# EAGLE design rpiInterface (EAGLE 9.4.2)
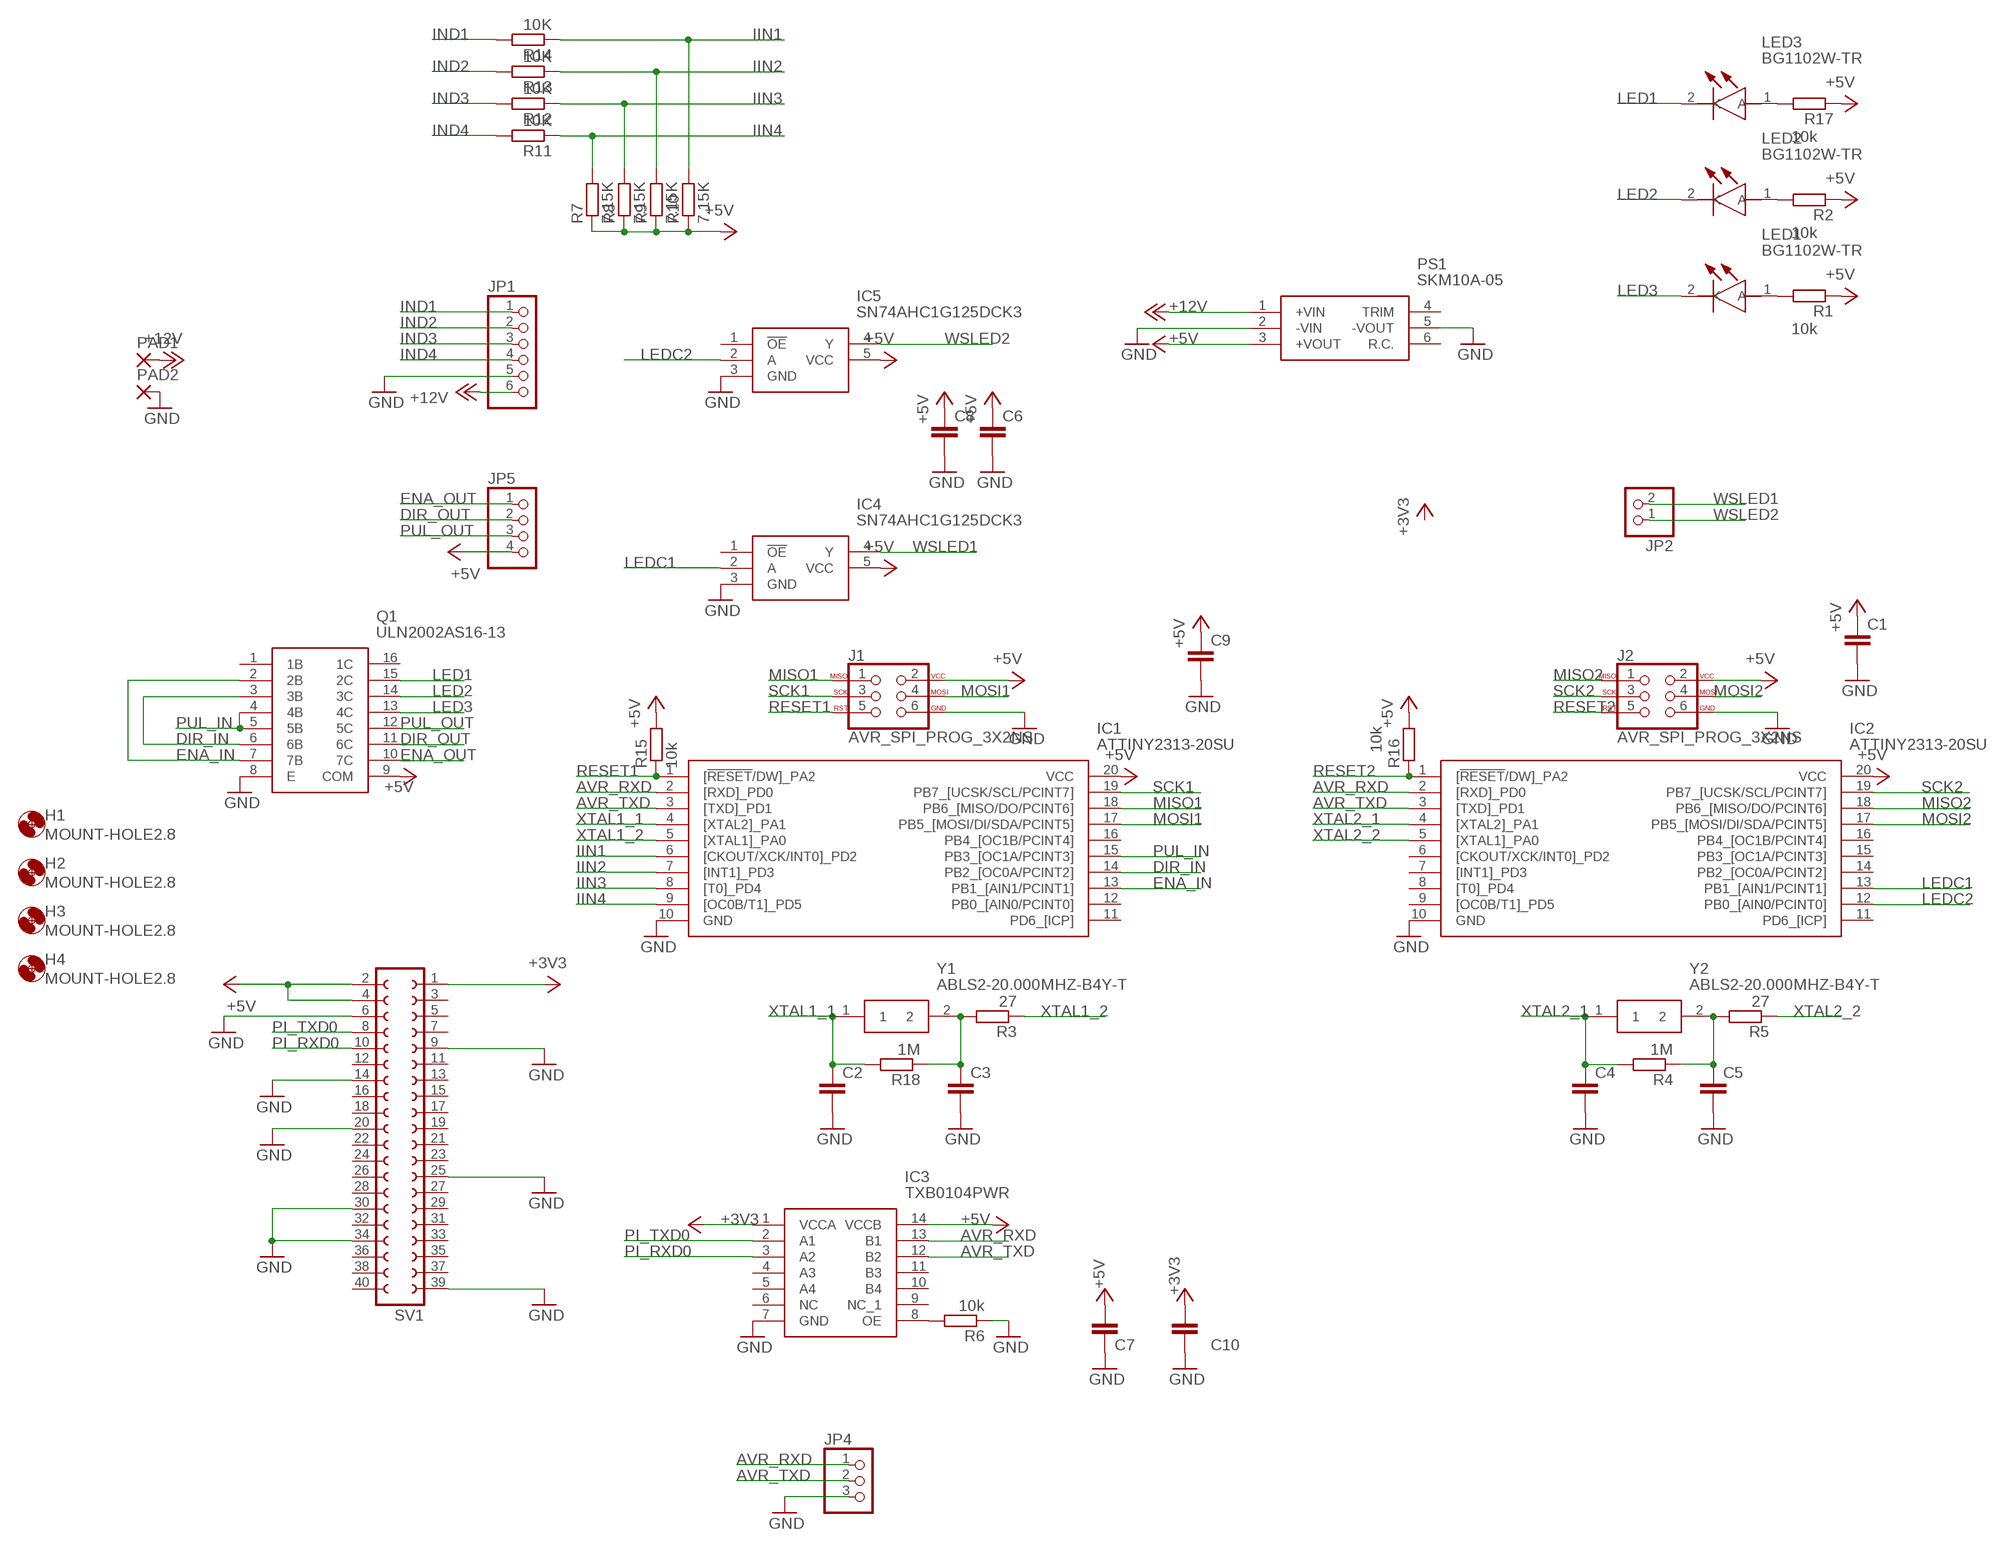
[diagram p0: schematic, sheet 1]

## Parts
C1  C-EUC1206  [C1206]
C2  C-EUC1206  [C1206]
C3  C-EUC1206  [C1206]
C4  C-EUC1206  [C1206]
C5  C-EUC1206  [C1206]
C6  C-EUC1206  [C1206]
C7  C-EUC1206  [C1206]
C8  C-EUC1206  [C1206]
C9  C-EUC1206  [C1206]
C10  C-EUC1206  [C1206]
H1  MOUNT-HOLE2.8  [2,8]
H2  MOUNT-HOLE2.8  [2,8]
H3  MOUNT-HOLE2.8  [2,8]
H4  MOUNT-HOLE2.8  [2,8]
IC1  ATTINY2313-20SU  [SOIC127P1032X265-20N]
IC2  ATTINY2313-20SU  [SOIC127P1032X265-20N]
IC3  TXB0104PWR  [SOP65P640X120-14N]
IC4  SN74AHC1G125DCK3  [SOT65P210X110-5N]
IC5  SN74AHC1G125DCK3  [SOT65P210X110-5N]
J1  AVR_SPI_PROG_3X2NS  [2X3-NS]
J2  AVR_SPI_PROG_3X2NS  [2X3-NS]
JP1  PINHD-1X6  [1X06]
JP2  PINHD-1X2  [1X02]
JP4  PINHD-1X3  [1X03]
JP5  PINHD-1X4  [1X04]
LED1  BG1102W-TR  [BG1102WTR]
LED2  BG1102W-TR  [BG1102WTR]
LED3  BG1102W-TR  [BG1102WTR]
PAD1  3,17/1,3  [3,17/1,3]
PAD2  3,17/1,3  [3,17/1,3]
PS1  SKM10A-05  [SKM10A05]
Q1  ULN2002AS16-13  [SOIC127P605X126-16N]
R1  10k  R-EU_R1206  [R1206]
R2  10k  R-EU_R1206  [R1206]
R3  27  R-EU_R1206  [R1206]
R4  1M  R-EU_R1206  [R1206]
R5  27  R-EU_R1206  [R1206]
R6  10k  R-EU_R1206  [R1206]
R7  7.15K  R-EU_R1206  [R1206]
R8  7.15K  R-EU_R1206  [R1206]
R9  7.15K  R-EU_R1206  [R1206]
R10  7.15K  R-EU_R1206  [R1206]
R11  10K  R-EU_R1206  [R1206]
R12  10K  R-EU_R1206  [R1206]
R13  10K  R-EU_R1206  [R1206]
R14  10K  R-EU_R1206  [R1206]
R15  10k  R-EU_R1206  [R1206]
R16  10k  R-EU_R1206  [R1206]
R17  10k  R-EU_R1206  [R1206]
R18  1M  R-EU_R1206  [R1206]
SV1  FE20-2  [FE20-2]
Y1  ABLS2-20.000MHZ-B4Y-T  [HC/49US-(AT49)_1]
Y2  ABLS2-20.000MHZ-B4Y-T  [HC/49US-(AT49)_1]

## Nets
+3V3: C10.1 IC3.1(VCCA) SV1.1
+5V: C1.1 C6.1 C7.1 C8.1 C9.1 IC1.20(VCC) IC2.20(VCC) IC3.14(VCCB) IC4.5(VCC) IC5.5(VCC) J1.2 J2.2 JP5.4 PS1.3(+VOUT) Q1.9(COM) R1.1 R2.1 R7.1 R8.1 R9.1 R10.1 R15.2 R16.2 R17.1 SV1.2 SV1.4
+12V: JP1.6 PAD1.1(P) PS1.1(+VIN)
AVR_RXD: IC1.2([RXD]_PD0) IC2.2([RXD]_PD0) IC3.13(B1) JP4.1
AVR_TXD: IC1.3([TXD]_PD1) IC2.3([TXD]_PD1) IC3.12(B2) JP4.2
DIR_IN: IC1.14(PB2_[OC0A/PCINT2]) Q1.3(3B) Q1.6(6B)
DIR_OUT: JP5.2 Q1.11(6C)
ENA_IN: IC1.13(PB1_[AIN1/PCINT1]) Q1.2(2B) Q1.7(7B)
ENA_OUT: JP5.1 Q1.10(7C)
GND: C1.2 C2.2 C3.2 C4.2 C5.2 C6.2 C7.2 C8.2 C9.2 C10.2 IC1.10(GND) IC2.10(GND) IC3.7(GND) IC4.3(GND) IC5.3(GND) J1.6 J2.6 JP1.5 JP4.3 PAD2.1(P) PS1.2(-VIN) PS1.5(-VOUT) Q1.8(E) R6.1 SV1.6 SV1.9 SV1.14 SV1.20 SV1.25 SV1.30 SV1.34 SV1.39
IIN1: IC1.6([CKOUT/XCK/INT0]_PD2) R10.2 R14.1
IIN2: IC1.7([INT1]_PD3) R9.2 R13.1
IIN3: IC1.8([T0]_PD4) R8.2 R12.1
IIN4: IC1.9([OC0B/T1]_PD5) R7.2 R11.1
IND1: JP1.1 R14.2
IND2: JP1.2 R13.2
IND3: JP1.3 R12.2
IND4: JP1.4 R11.2
LED1: LED3.2(K) Q1.15(2C)
LED2: LED2.2(K) Q1.14(3C)
LED3: LED1.2(K) Q1.13(4C)
LEDC1: IC2.13(PB1_[AIN1/PCINT1]) IC4.2(A)
LEDC2: IC2.12(PB0_[AIN0/PCINT0]) IC5.2(A)
MISO1: IC1.18(PB6_[MISO/DO/PCINT6]) J1.1
MISO2: IC2.18(PB6_[MISO/DO/PCINT6]) J2.1
MOSI1: IC1.17(PB5_[MOSI/DI/SDA/PCINT5]) J1.4
MOSI2: IC2.17(PB5_[MOSI/DI/SDA/PCINT5]) J2.4
N$1: C3.1 R3.2 R18.1 Y1.2
N$2: C5.1 R4.1 R5.2 Y2.2
N$3: LED1.1(A) R1.2
N$4: LED2.1(A) R2.2
N$5: LED3.1(A) R17.2
N$6: IC3.8(OE) R6.2
PI_RXD0: IC3.3(A2) SV1.10
PI_TXD0: IC3.2(A1) SV1.8
PUL_IN: IC1.15(PB3_[OC1A/PCINT3]) Q1.4(4B) Q1.5(5B)
PUL_OUT: JP5.3 Q1.12(5C)
RESET1: IC1.1([!RESET!/DW]_PA2) J1.5 R15.1
RESET2: IC2.1([!RESET!/DW]_PA2) J2.5 R16.1
SCK1: IC1.19(PB7_[UCSK/SCL/PCINT7]) J1.3
SCK2: IC2.19(PB7_[UCSK/SCL/PCINT7]) J2.3
WSLED1: IC4.4(Y) JP2.2
WSLED2: IC5.4(Y) JP2.1
XTAL1_1: C2.1 IC1.4([XTAL2]_PA1) R18.2 Y1.1
XTAL1_2: IC1.5([XTAL1]_PA0) R3.1
XTAL2_1: C4.1 IC2.4([XTAL2]_PA1) R4.2 Y2.1
XTAL2_2: IC2.5([XTAL1]_PA0) R5.1
Unconnected: IC1.11(PD6_[ICP]) IC1.12(PB0_[AIN0/PCINT0]) IC1.16(PB4_[OC1B/PCINT4]) IC2.6([CKOUT/XCK/INT0]_PD2) IC2.7([INT1]_PD3) IC2.8([T0]_PD4) IC2.9([OC0B/T1]_PD5) IC2.11(PD6_[ICP]) IC2.14(PB2_[OC0A/PCINT2]) IC2.15(PB3_[OC1A/PCINT3]) IC2.16(PB4_[OC1B/PCINT4]) IC3.4(A3) IC3.5(A4) IC3.6(NC) IC3.9(NC_1) IC3.10(B4) IC3.11(B3) IC4.1(!OE) IC5.1(!OE) PS1.4(TRIM) PS1.6(R.C.) Q1.1(1B) Q1.16(1C) SV1.3 SV1.5 SV1.7 SV1.11 SV1.12 SV1.13 SV1.15 SV1.16 SV1.17 SV1.18 SV1.19 SV1.21 SV1.22 SV1.23 SV1.24 SV1.26 SV1.27 SV1.28 SV1.29 SV1.31 SV1.32 SV1.33 SV1.35 SV1.36 SV1.37 SV1.38 SV1.40

## Library data of the parts
C1-C10 = rcl:C-EU: CAPACITOR, European symbol; SPICEPREFIX: C
H1-H4 = holes:MOUNT-HOLE: MOUNTING HOLE with drill center marker
IC1 IC2 = SamacSys_Parts:ATTINY2313-20SU: ATTINY2313-20SU, 8 bit AVR Microcontroller 20MHz 2, 128kB, B Flash, 128B RAM, I2C SPI 20-Pin SOIC Source: Datasheet <https://componentsearchengine.com/Datasheets/1/ATTINY2313-20SU.pdf>; DESCRIPTION: ATTINY2313-20SU, 8 bit AVR Microcontroller 20MHz 2, 128kB, B Flash, 128B RAM, I2C SPI 20-Pin SOIC; HEIGHT: 2.65mm; MANUFACTURER_NAME: Microchip; MANUFACTURER_PART_NUMBER: ATTINY2313-20SU; MOUSER_PART_NUMBER: 556-ATTINY2313-20SU; MOUSER_PRICE-STOCK: https://www.mouser.com/Search/Refine.aspx?Keyword=556-ATTINY2313-20SU
IC3 = SamacSys_Parts:TXB0104PWR: 4-Bit Bidirectional Voltage-Level Shifter with Auto Direction Sensing and +/-15 kV ESD Protect Source: Datasheet <http://www.ti.com/lit/ds/symlink/txb0104.pdf>; DESCRIPTION: 4-Bit Bidirectional Voltage-Level Shifter with Auto Direction Sensing and +/-15 kV ESD Protect; HEIGHT: 1.2mm; MANUFACTURER_NAME: Texas Instruments; MANUFACTURER_PART_NUMBER: TXB0104PWR; MOUSER_PART_NUMBER: 595-TXB0104PWR; MOUSER_PRICE-STOCK: https://www.mouser.com/Search/Refine.aspx?Keyword=595-TXB0104PWR
IC4 IC5 = SamacSys_Parts:SN74AHC1G125DCK3: Buffers & Line Drivers SN74AHC1G125DCK3 Source: Datasheet <http://www.ti.com/lit/ds/symlink/sn74ahc1g125.pdf>; DESCRIPTION: Buffers & Line Drivers SN74AHC1G125DCK3; HEIGHT: 1.1mm; MANUFACTURER_NAME: Texas Instruments; MANUFACTURER_PART_NUMBER: SN74AHC1G125DCK3; MOUSER_PART_NUMBER: 595-SN74AHC1G125DCK3; MOUSER_PRICE-STOCK: https://www.mouser.com/Search/Refine.aspx?Keyword=595-SN74AHC1G125DCK3
J1 J2 = SparkFun-Connectors:AVR_SPI_PROG_3X2: AVR ISP 6 Pin This is the reduced ISP connector for AVR programming. Common on Arduino. This footprint will take up less PCB space and can be used with a 10-pin to 6-pin adapter such as SKU: BOB-08508 **Special note about "TEST_POINT" package. The stop mask is on the top side, so if you want your programming test points to be on the bottom of your board, make sure to place this package on the bottom side of the board. This also ensure that the orientation to program from the bottom side will be correct. SparkFun Products: SparkFun ISP Pogo Adapter <https://www.sparkfun.com/products/11591> - NS Tiny AVR Programmer <https://www.sparkfun.com/products/11801> -PTH
JP1 = pinhead:PINHD-1X6: PIN HEADER
JP2 = pinhead:PINHD-1X2: PIN HEADER
JP4 = pinhead:PINHD-1X3: PIN HEADER
JP5 = pinhead:PINHD-1X4: PIN HEADER
LED1-LED3 = SamacSys_Parts:BG1102W-TR: Stanley Electric 1102W 558 nm Green LED, 3216 (1206) SMD package Source: Datasheet <https://media.digikey.com/pdf/Data Sheets/Stanley Electric PDFs/1102W_Series.pdf>; DESCRIPTION: Stanley Electric 1102W 558 nm Green LED, 3216 (1206) SMD package; HEIGHT: 1mm; MANUFACTURER_NAME: Stanley Electric; MANUFACTURER_PART_NUMBER: BG1102W-TR; MOUSER_PART_NUMBER: 327-BG1102WTR; MOUSER_PRICE-STOCK: https://www.mouser.com/Search/Refine.aspx?Keyword=327-BG1102WTR
PAD1 PAD2 = wirepad:3,17/1,3: THROUGH-HOLE PAD
PS1 = SamacSys_Parts:SKM10A-05: Isolated DC/DC Converters 9-18Vin 5Vout 2000mA DIP Iso Reg Source: Datasheet <https://www.arrow.com/en/products/skm10a-05/mean-well-enterprises>; DESCRIPTION: Isolated DC/DC Converters 9-18Vin 5Vout 2000mA DIP Iso Reg; HEIGHT: 10.7mm; MANUFACTURER_NAME: Mean Well; MANUFACTURER_PART_NUMBER: SKM10A-05; MOUSER_PART_NUMBER: 709-SKM10A-05; MOUSER_PRICE-STOCK: https://www.mouser.com/Search/Refine.aspx?Keyword=709-SKM10A-05
Q1 = SamacSys_Parts:ULN2002AS16-13: Darlington Transistors High Volt Darlington 7Drivers 500mA 250ns Source: Datasheet <https://componentsearchengine.com/Datasheets/1/ULN2002AS16-13.pdf>; DESCRIPTION: Darlington Transistors High Volt Darlington 7Drivers 500mA 250ns; HEIGHT: 1.26mm; MANUFACTURER_NAME: Diodes Inc.; MANUFACTURER_PART_NUMBER: ULN2002AS16-13; MOUSER_PART_NUMBER: 621-ULN2002AS16-13; MOUSER_PRICE-STOCK: https://www.mouser.com/Search/Refine.aspx?Keyword=621-ULN2002AS16-13
R1-R18 = rcl:R-EU_: RESISTOR, European symbol; SPICEPREFIX: R
SV1 = con-lsta:FE20-2: FEMALE HEADER; OC_FARNELL: unknown; OC_NEWARK: unknown
Y1 Y2 = SamacSys_Parts:ABLS2-20.000MHZ-B4Y-T: Crystals 20.000MHZ, 18pF 30ppm -20C +70C Source: Datasheet <https://componentsearchengine.com/Datasheets/1/ABLS2-20.000MHz-B4Y-T.pdf>; DESCRIPTION: Crystals 20.000MHZ, 18pF 30ppm -20C +70C; HEIGHT: mm; MANUFACTURER_NAME: ABRACON; MANUFACTURER_PART_NUMBER: ABLS2-20.000MHz-B4Y-T; MOUSER_PART_NUMBER: 815-ABLS2-20-B4YT; MOUSER_PRICE-STOCK: https://www.mouser.com/Search/Refine.aspx?Keyword=815-ABLS2-20-B4YT

## Board
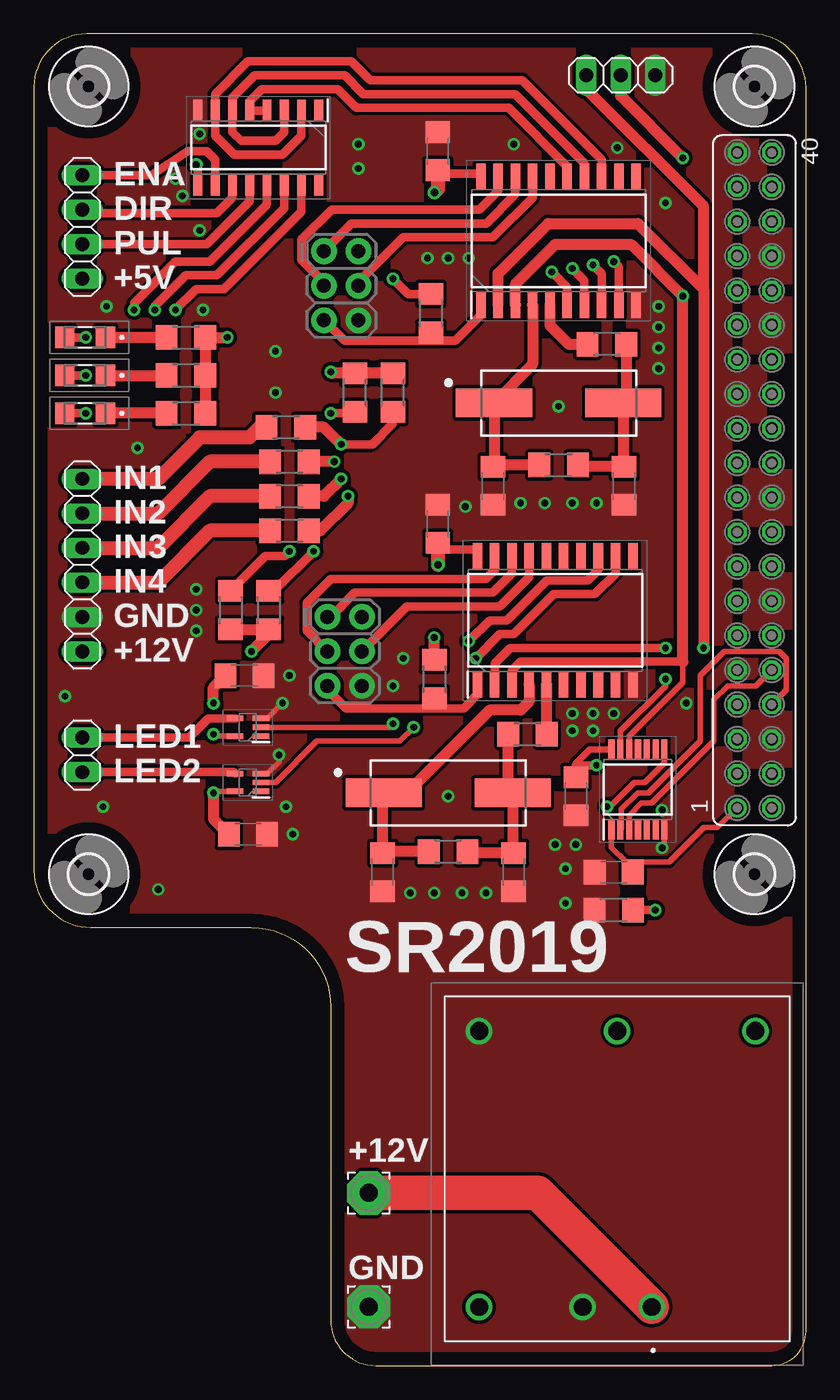
[diagram p1: board, top side]
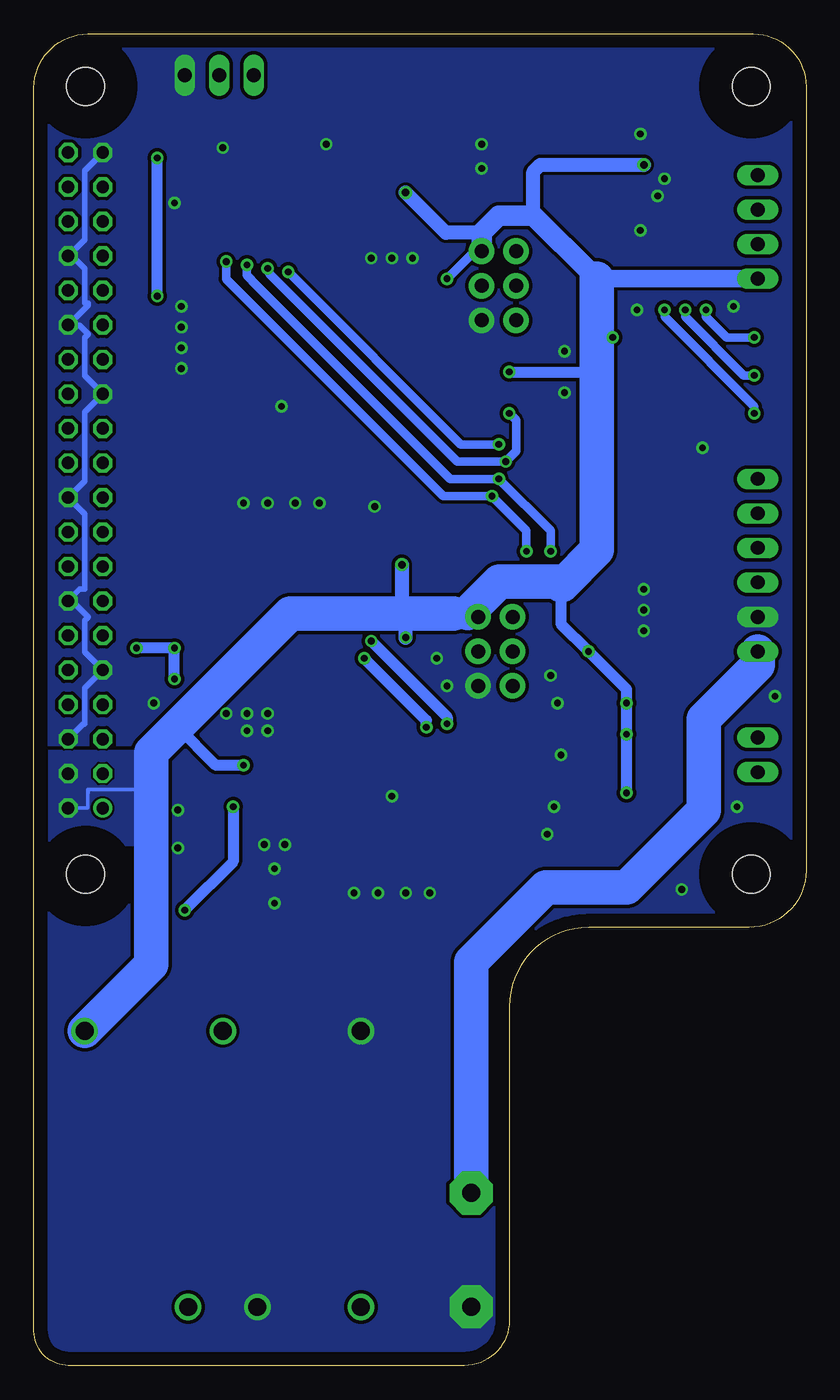
[diagram p2: board, bottom side, seen from below]

Size 56.82 x 98.03 mm. Coordinates in mm from the lower left corner, seen from the top.
Outline: 21.84,26.42 21.84,3.3 arc90 25.15,0 54.28,0 arc90 56.82,2.54 56.82,94.08 arc90 52.86,98.03 3.88,98.03 arc90 0,94.16 0,36.44 arc90 4.19,32.26 16,32.26 arc-90 21.84,26.42
Copper layers (1*16): Top 0.035mm / dielectric 1.5mm / Bottom 0.035mm
Design rules "default *": minimum track width 6mil, minimum drill 0.35mm, track to track 6mil, track to pad 6mil, pad to pad 6mil, via to via 6mil, smd to smd 6mil, copper to edge 40mil, drill to drill 6mil, minimum pad ring 10mil, minimum via ring 8mil, stop-mask expansion 4mil, vias tented up to drill 50mil, thermal gap 10mil

### Footprints (pad centres in the part's own frame; a part is rotated, then mirrored left to right if it is on the bottom)
C1206 = smd 1.6 x 1.8: 1 -1.4,0; 2 1.4,0
2,8 = hole 2.8: 0,0
SOIC127P1032X265-20N = smd 1.925 x 0.7: 1 -4.712,5.715; 2 -4.712,4.445; 3 -4.712,3.175; 4 -4.712,1.905; 5 -4.712,0.635; 6 -4.712,-0.635; 7 -4.712,-1.905; 8 -4.712,-3.175; 9 -4.712,-4.445; 10 -4.712,-5.715; 11 4.712,-5.715; 12 4.712,-4.445; 13 4.712,-3.175; 14 4.712,-1.905; 15 4.712,-0.635; 16 4.712,0.635; 17 4.712,1.905; 18 4.712,3.175; 19 4.712,4.445; 20 4.712,5.715
SOP65P640X120-14N = smd 1.475 x 0.45: 1 -2.938,1.95; 2 -2.938,1.3; 3 -2.938,0.65; 4 -2.938,0; 5 -2.938,-0.65; 6 -2.938,-1.3; 7 -2.938,-1.95; 8 2.938,-1.95; 9 2.938,-1.3; 10 2.938,-0.65; 11 2.938,0; 12 2.938,0.65; 13 2.938,1.3; 14 2.938,1.95
SOT65P210X110-5N = smd 1.2 x 0.4: 1 -0.95,0.65; 2 -0.95,0; 3 -0.95,-0.65; 4 0.95,-0.65; 5 0.95,0.65
2X3-NS = drill 1.016 pad 1.88: 1 -2.54,-1.27; 2 -2.54,1.27; 3 0,-1.27; 4 0,1.27; 5 2.54,-1.27; 6 2.54,1.27
1X06 = drill 1.016 long: 1 -6.35,0; 2 -3.81,0; 3 -1.27,0; 4 1.27,0; 5 3.81,0; 6 6.35,0
1X02 = drill 1.016 long: 1 -1.27,0; 2 1.27,0
1X03 = drill 1.016 long: 1 -2.54,0; 2 0,0; 3 2.54,0
1X04 = drill 1.016 long: 1 -3.81,0; 2 -1.27,0; 3 1.27,0; 4 3.81,0
BG1102WTR = smd 1.6 x 1.4: 1 0,1.2; 2 0,-1.8
3,17/1,3 = drill 1.321 pad 3.175 octagon: 1 0,0
SKM10A05 = drill 1.3 pad 1.95: 1 0,0; 2 -5.08,0; 3 7.62,20.32; 4 -2.54,20.32; 5 -12.7,20.32; 6 -12.7,0
SOIC127P605X126-16N = smd 1.575 x 0.65: 1 -2.738,4.445; 2 -2.738,3.175; 3 -2.738,1.905; 4 -2.738,0.635; 5 -2.738,-0.635; 6 -2.738,-1.905; 7 -2.738,-3.175; 8 -2.738,-4.445; 9 2.738,-4.445; 10 2.738,-3.175; 11 2.738,-1.905; 12 2.738,-0.635; 13 2.738,0.635; 14 2.738,1.905; 15 2.738,3.175; 16 2.738,4.445
R1206 = smd 1.6 x 1.803: 1 -1.422,0; 2 1.422,0
FE20-2 = drill 0.914: 1 -24.13,1.27 | drill 0.914 octagon: 2 -24.13,-1.27; 3 -21.59,1.27; 4 -21.59,-1.27; 5 -19.05,1.27; 6 -19.05,-1.27; 7 -16.51,1.27; 8 -16.51,-1.27; 9 -13.97,1.27; 10 -13.97,-1.27; 11 -11.43,1.27; 12 -11.43,-1.27; 13 -8.89,1.27; 14 -8.89,-1.27; 15 -6.35,1.27; 16 -6.35,-1.27; 17 -3.81,1.27; 18 -3.81,-1.27; 19 -1.27,1.27; 20 -1.27,-1.27; 21 1.27,1.27; 22 1.27,-1.27; 23 3.81,1.27; 24 3.81,-1.27; 25 6.35,1.27; 26 6.35,-1.27; 27 8.89,1.27; 28 8.89,-1.27; 29 11.43,1.27; 30 11.43,-1.27; 31 13.97,1.27; 32 13.97,-1.27; 33 16.51,1.27; 34 16.51,-1.27; 35 19.05,1.27; 36 19.05,-1.27; 37 21.59,1.27; 38 21.59,-1.27; 39 24.13,1.27; 40 24.13,-1.27
HC/49US-(AT49)_1 = smd 5.6 x 2.1: 1 -4.75,0; 2 4.75,0

### Placement (x,y rotation side)
C1  39.88,41.91 270 top
C2  33.78,64.77 270 top
C3  43.43,64.77 270 top
C4  25.65,36.32 270 top
C5  35.31,36.32 270 top
C6  15.75,39.12 0 top
C7  29.72,61.98 90 top
C8  15.49,50.8 0 top
C9  29.72,89.41 90 top
C10  42.67,36.32 180 top
H1  4.03,36.17 0 top
H2  53.03,36.17 0 top
H3  4.03,94.17 0 top
H4  53.03,94.17 0 top
IC1  38.61,82.8 90 top
IC2  38.35,54.86 90 top
IC3  44.45,42.42 90 top
IC4  15.75,46.99 180 top
IC5  15.75,42.93 180 top
J1  22.61,79.5 270 top
J2  22.86,52.58 270 top
JP1  3.56,58.93 270 top
JP2  3.56,44.96 90 top
JP4  43.18,95 0 top
JP5  3.56,83.82 270 top
LED1  4.06,75.69 270 top
LED2  4.06,72.9 270 top
LED3  4.06,70.1 270 top
PAD1  24.64,12.7 0 top
PAD2  24.64,4.32 0 top
PS1  45.47,4.32 0 top
Q1  16.51,89.66 270 top
R1  11.18,75.69 180 top
R2  11.18,72.9 180 top
R3  42.16,75.18 0 top
R4  30.48,37.85 180 top
R5  36.32,46.48 180 top
R6  42.67,33.53 0 top
R7  17.27,55.63 90 top
R8  14.48,55.63 90 top
R9  23.62,71.63 270 top
R10  26.42,71.63 270 top
R11  18.8,61.47 180 top
R12  18.8,64.01 180 top
R13  18.8,66.55 180 top
R14  18.54,69.09 180 top
R15  29.21,77.47 90 top
R16  29.46,50.55 90 top
R17  11.18,70.1 180 top
R18  38.61,66.29 180 top
SV1  53.03,65.17 90 top
Y1  38.61,70.87 0 top
Y2  30.48,42.16 0 top

### Tracks (layer width: path | path; a pad name or v marks a point on that pad's centre or on a via)
+3V3
  Top 0.406: SV1.1 50.29,39.62 49.28,39.62 46.74,37.08 43.94,37.08 | IC3.1 42.5,38.16 43.57,37.08 43.94,37.08 | C10.1 44.07,36.95 43.94,37.08
+5V  (via drill 0.5, 0.55)
  Top 0.406: IC5.5 13.32,42.28 v13.21,42.16 | IC4.5 13.35,46.34 v13.21,46.48
  Top 0.508: IC3.14 42.48,45.33 40.89,45.34 39.88,44.33 C1.1
  Top 0.61: C9.1 29.97,87.75 32.66,87.75 IC1.20 | C7.1 30.23,60.07 32.64,60.07 IC2.20 | v26.42,80.01 27.53,78.89 R15.2 | C1.1 39.88,44.2 v41.4,44.2 | Q1.9 12.06,88.27 v11.94,88.39
  Top 0.813: R8.1 R7.1 17.27,53.85 v16,52.58 | R17.1 R2.1 R1.1 v14.22,75.69 | R16.2 v29.46,53.59 | R10.1 R9.1 21.95,73.05 v21.84,73.15 | v13.21,48.77 13.21,49.91 C8.1 | v13.21,42.16 13.21,40.26 C6.1
  Top 1.016: v29.74,58.95 29.74,60.55 C7.1 | C9.1 29.72,86.61 v29.46,86.36
  Bottom 0.254: SV1.2 52.85,41.04 52.85,42.14 | 52.85,42.14 52.83,42.14 52.83,42.42 | 52.85,42.14 52.85,42.42 48.2,42.42
  Bottom 0.61: v26.42,80.01 24.38,82.04 J1.2 | 16,73.15 16,73.58 15.41,74.17 15.75,74.5 15.75,75.69 | 29.46,54.86 28.96,55.37 28.45,55.37 | 25.91,55.37 25.65,55.12 | J2.2 25.65,55.12 | 25.65,55.12 25.37,55.4 24.9,55.4 | 48.2,39.37 48.2,41.09 48.77,41.66 48.77,39.93 48.2,39.37
  Bottom 0.813: 18.03,57.73 18.03,57.48 18.03,54.61 v16,52.58 13.21,49.78 v13.21,48.77 v13.21,46.48 v13.21,42.16 | 29.74,55.14 29.46,54.86 | v21.84,73.15 16,73.15 | v14.22,75.69 15.75,75.69 | v41.4,44.2 43.43,44.2 46.29,47.05
  Bottom 1.016: 23.88,83.39 26.5,83.39 v29.46,86.36 | 20.06,84.66 20.06,87.89 19.56,88.39 v11.94,88.39 | v29.74,58.95 29.74,55.14 | v29.46,53.59 29.46,54.36 28.45,55.37
  Bottom 1.27: JP5.4 15.41,80.01 15.75,80.35
  Bottom 1.524: J1.2 23.88,83.39 22.61,84.66 20.06,84.66 15.75,80.35
  Bottom 2.54: PS1.3 48.2,29.52 48.2,39.37 48.2,42.42 48.2,45.13 46.29,47.05 37.97,55.37 28.45,55.37 25.91,55.37 | 24.9,55.4 22.57,57.73 18.03,57.73 | 18.03,57.48 17.96,57.48 15.41,60.03 15.41,74.17 15.41,80.01
  pour Bottom (no thermals): 49.28,45.21 55.88,45.21 55.88,38.35 49.28,38.35
+12V
  Top 2.54: PS1.1 37.08,12.7 PAD1.1
  Bottom 2.54: PAD1.1 24.64,29.72 19.15,35.21 13.19,35.21 7.52,40.88 7.52,47.6 3.56,51.56 JP1.6
AVR_RXD  (via drill 0.5)
  Top 0.406: v46.48,50.55 46.48,50.04 43.15,46.71 IC3.13
  Top 0.61: IC2.2 33.91,51.69 35.05,52.83 v46.48,52.83
  Top 0.813: IC1.2 34.16,80.39 37.85,84.07 44.45,84.07 49.28,79.25 | 49.28,79.25 v49.28,52.83 | 49.28,79.25 49.28,85.34 40.64,93.98 JP4.1
  Bottom 0.813: v46.48,50.55 v46.48,52.83 v49.28,52.83
AVR_TXD  (via drill 0.5)
  Top 0.406: 47.75,51.82 47.75,50.29 43.8,46.34 IC3.12
  Top 0.61: IC2.3 35.18,51.18 35.81,51.82 47.75,51.82
  Top 0.813: IC1.3 35.43,79.63 38.35,82.55 43.94,82.55 v47.75,78.74 47.75,51.82 | v47.75,88.9 43.18,93.47 JP4.2
  Bottom 0.813: v47.75,78.74 v47.75,88.9
DIR_IN
  Top 0.61: IC1.14 40.51,88.53 35.43,93.61 24.24,93.61 22.86,95 16.26,95 14.6,93.35 Q1.6 14.6,90.81 15.24,90.17 17.78,90.17 18.41,90.81 Q1.3
DIR_OUT
  Top 0.61: JP5.2 3.81,84.84 13.46,84.84 14.6,85.98 Q1.11
ENA_IN
  Top 0.61: IC1.13 41.78,88.79 35.94,94.63 24.75,94.63 23.37,96.01 15.75,96.01 13.33,93.6 Q1.7 13.33,90.55 14.73,89.15 18.29,89.15 19.69,90.55 Q1.2
ENA_OUT
  Top 0.61: JP5.1 8.64,87.63 11.3,89.41 12.7,89.41 13.33,88.77 Q1.10
GND  (via drill 0.5)
  Top 0.406: IC5.3 17.16,43.58 18.03,44.45 v18.03,44.96 | IC4.3 17.16,47.64 v18.29,48.77 | IC3.7 46.4,38.27 v46.23,38.1
  Bottom 0.406: SV1.6 53.18,47.24 53.09,47.24 53.09,49.88 SV1.9 53.09,52.53 53.09,54.86 52.83,55.12 54,56.28 SV1.14 53.43,57.15 53.09,57.15 53.09,62.69 SV1.20 53.09,65.12 53.09,70.2 SV1.25 51.76,71.57 53.09,72.9 53.09,75.69 52.83,75.95 53.49,76.6 SV1.30 52.83,78.07 52.83,78.23 53.09,78.23 53.09,80.77 54,81.68 SV1.34 53.09,82.9 53.09,87.98 SV1.39
  other vias: 35.31,89.92 28.96,81.53 31.75,63.25 41.4,63.5 35.81,63.5 27.69,34.8 42.67,48.01 29.46,34.8 10.92,86.11 10.41,87.38 23.88,89.92 23.88,88.14 30.48,81.53 32,81.53 12.19,83.57 37.59,63.5 39.62,63.5 33.27,34.8 31.5,34.8 39.88,38.35 39.12,36.58 38.35,38.35 46.23,40.89 39.12,34.04 18.54,41.15 19.05,39.12 18.8,50.8 26.42,50.04 27.18,52.07 11.94,57.15 11.94,54.1 11.94,55.63 17.78,74.68 17.78,71.63 12.45,77.72 7.62,67.56 5.33,77.98 12.19,90.68 46.48,85.6 30.48,41.91 38.61,70.61 45.97,77.98 45.97,76.45 45.97,74.93 45.97,73.41 41.15,48.01 39.62,48.01 39.62,46.74 41.15,46.74 9.14,35.05 5.08,41.15 2.29,49.28 48.01,48.77 42.93,89.66
  pour Top (isolate 0.254, no thermals): -1.02,99.06 58.67,99.06 58.67,-0.51 -1.02,-0.51
  pour Bottom (isolate 0.254, no thermals): -2.54,100.33 57.4,100.33 57.4,45.72 46.99,45.72 46.99,37.85 57.15,37.85 57.15,-9.51 -2.54,3.34
IIN1  (via drill 0.5)
  Top 0.61: IC1.6 39.24,79.38 v38.1,80.52 | v22.61,67.82 24.89,67.82 26.42,69.34 R10.2
  Top 0.813: v22.61,67.82 21.34,69.09 R14.1
  Bottom 0.61: v38.1,80.52 25.4,67.82 v22.61,67.82
IIN2  (via drill 0.5)
  Top 0.61: IC1.7 40.51,79.88 v39.62,80.77 | R9.2 23.52,70.1 v21.84,70.1
  Top 0.813: v22.1,66.55 R13.1
  Bottom 0.61: v39.62,80.77 39.52,80.67 39.52,80.4 25.67,66.55 v22.1,66.55 21.34,67.31 21.34,69.6 v21.84,70.1
IIN3  (via drill 0.5)
  Top 0.61: IC1.8 41.78,80.39 v41.15,81.03 | v18.8,59.94 18.44,59.59 17.02,59.59 R8.2
  Top 0.813: v22.61,65.28 21.34,64.01 R12.1
  Bottom 0.61: v41.15,81.03 41.15,80.26 40.79,79.9 40.79,79.89 26.18,65.28 v22.61,65.28 18.8,61.47 v18.8,59.94
IIN4  (via drill 0.5)
  Top 0.61: IC1.9 43.05,80.9 v42.67,81.28 | v20.57,59.94 17.68,57.05 R7.2
  Top 0.813: v23.11,64.01 23.11,63.5 21.08,61.47 R11.1
  Bottom 0.61: v42.67,81.28 42.67,79.99 26.69,64.01 v23.11,64.01 20.57,61.47 v20.57,59.94
IND1
  Top 1.016: JP1.1 9.14,65.28 12.19,68.33 15.85,68.33 16.61,69.09 R14.2
IND2
  Top 1.016: R13.2 12.95,66.55 9.14,62.74 JP1.2
IND3
  Top 1.016: R12.2 12.95,64.01 9.14,60.2 JP1.3
IND4
  Top 1.016: R11.2 12.95,61.47 9.14,57.66 JP1.4
LED1  (via drill 0.5)
  Top 0.61: LED3.2 v3.81,70.1 | v10.41,77.72 11.94,79.25 13.97,79.25 19.69,84.96 Q1.15
  Bottom 0.61: v3.81,70.1 3.81,70.61 10.41,77.22 v10.41,77.72
LED2  (via drill 0.5)
  Top 0.61: LED2.2 v3.81,72.9 | v8.89,77.72 8.89,77.98 11.18,80.26 13.46,80.26 18.41,85.22 Q1.14
  Bottom 0.61: v3.81,72.9 4.57,72.9 8.89,77.22 v8.89,77.72
LED3  (via drill 0.5)
  Top 0.61: LED1.2 v3.81,75.69 | v7.37,77.72 7.37,78.23 10.41,81.28 12.95,81.28 17.14,85.47 Q1.13
  Bottom 0.61: v3.81,75.69 5.84,75.69 7.37,77.22 v7.37,77.72
LEDC1  (via drill 0.5)
  Top 0.406: IC4.2 26.16,46.99 v26.42,47.24
  Top 0.61: v32,53.34 33.53,54.86 34.8,54.86 37.73,57.8 40.77,57.8 41.53,58.56 IC2.13
  Bottom 0.813: v32,53.34 26.42,47.75 v26.42,47.24
LEDC2  (via drill 0.5)
  Top 0.406: IC5.2 17.78,42.93 20.83,45.97 26.92,45.97 v27.94,46.99
  Top 0.61: v32.51,52.07 34.29,53.85 35.31,53.85 38.24,56.78 41.27,56.78 42.8,58.31 IC2.12
  Bottom 0.813: v27.94,46.99 27.94,47.5 v32.51,52.07
MISO1
  Top 0.61: J1.1 23.37,84.07 33.27,84.07 35.43,86.23 IC1.18
MISO2
  Top 0.61: J2.1 21.84,55.12 23.62,56.9 33.77,56.9 35.18,58.31 IC2.18
MOSI1
  Top 0.61: IC1.17 36.7,85.98 33.78,83.06 27.18,83.06 23.88,79.76 J1.4
MOSI2
  Top 0.61: J2.4 27.43,55.88 34.29,55.88 36.45,58.04 IC2.17
N$1
  Top 0.61: Y1.2 43.59,70.64 43.59,70.46
  Top 0.813: R3.2 43.59,70.46 | Y1.2 43.36,66.25 C3.1 40.15,66.17 R18.1
N$2
  Top 0.61: Y2.2 34.9,42.49
  Top 0.813: 34.9,42.49 R5.2 | Y2.2 35.23,37.8 C5.1 32.03,37.72 R4.1
N$3
  Top 0.813: R1.2 LED1.1
N$4
  Top 0.813: LED2.1 R2.2
N$5
  Top 0.813: R17.2 LED3.1
N$6  (via drill 0.5)
  Top 0.406: IC3.8 46.4,44.37 44.96,42.93 44.2,42.93 42.42,41.15 v42.16,41.15
  Top 0.61: v45.72,33.53 R6.2
  Bottom 0.813: v42.16,41.15 42.16,37.08 v45.72,33.53
PI_RXD0
  Top 0.406: IC3.3 43.8,40.5 44.7,41.4 45.47,41.4 50.04,45.97 50.04,49.02 51.05,50.04 53.13,50.04 SV1.10
PI_TXD0
  Top 0.406: IC3.2 43.22,39.55 43.22,40.96 44.42,42.16 45.21,42.16 49.02,45.97 49.02,50.8 50.8,52.58 54.86,52.58 55.37,52.07 55.37,49.74 SV1.8
PUL_IN
  Top 0.61: IC1.15 39.24,88.28 34.93,92.6 23.74,92.6 22.35,93.98 16.76,93.98 15.87,93.09 Q1.5 Q1.4
PUL_OUT
  Top 0.61: JP5.3 12.7,82.55 15.87,85.73 Q1.12
RESET1
  Top 0.61: J1.5 22.86,75.44 29.21,75.44 | 29.21,75.44 30.99,75.44 32.89,77.34 IC1.1 | R15.1 29.21,75.44
RESET2
  Top 0.61: J2.5 21.59,49.78 23,48.37 29.72,48.37 | 29.72,48.37 31.62,48.37 32.64,49.39 IC2.1 | R16.1 29.72,48.87 29.72,48.37
SCK1
  Top 0.61: IC1.19 34.16,86.49 32.77,85.09 21.9,85.09 19.69,82.88 19.69,81.41 21.34,79.76 J1.3
SCK2
  Top 0.61: IC2.19 33.91,58.56 33.26,57.91 21.84,57.91 20.07,56.13 20.07,54.1 J2.3
WSLED1
  Top 0.61: IC4.4 12.84,47.64 11.43,46.23 JP2.2
WSLED2
  Top 0.61: IC5.4 14.69,43.69 JP2.1
XTAL1_1
  Top 0.813: IC1.4 36.7,73.71 Y1.1 33.86,66.25 C2.1 33.91,66.29 R18.2
XTAL1_2
  Top 0.813: IC1.5 37.97,76.58 39.37,75.18 R3.1
XTAL2_1
  Top 0.61: Y2.1 27.43,42.16
  Top 0.813: R4.2 25.78,37.85 C4.1 25.65,42.09 Y2.1 | IC2.4 36.45,48.89 35.81,48.26 33.53,48.26 27.43,42.16
XTAL2_2
  Top 0.813: IC2.5 37.72,46.51 R5.1

### Text on the board
tNames: ENA | DIR | PUL | +5V | IN1 | IN2 | IN3 | IN4 | GND | +12V | LED1 | LED2 | SR2019 | +12V | GND